# Altium schematic sheet Infinity Series 7 Breakout.SchDoc
size A; SheetNumber: 1; SheetTotal: 1
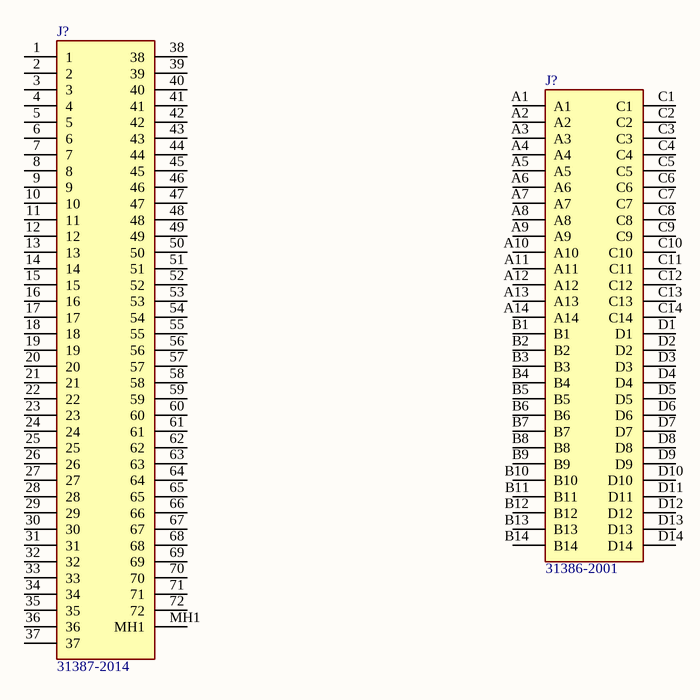
[diagram p0: Infinity Series 7 Breakout.SchDoc]

## Parts
(Parts that share a designator on the sheet are numbered #1, #2 ... from top to bottom, then left to right.)
J?#1  31387-2014  [313872014]
J?#2  31386-2001  [313862001]

## Nets

Not connected (* = marked no-connect by the designer): J?#1 1 2 3 4 5 6 7 8 9 10 11 12 13 14 15 16 17 18 19 20 21 22 23 24 25 26 27 28 29 30 31 32 33 34 35 36 37 38 39 40 41 42 43 44 45 46 47 48 49 50 51 52 53 54 55 56 57 58 59 60 61 62 63 64 65 66 67 68 69 70 71 72 MH1; J?#2 A1 A2 A3 A4 A5 A6 A7 A8 A9 A10 A11 A12 A13 A14 B1 B2 B3 B4 B5 B6 B7 B8 B9 B10 B11 B12 B13 B14 C1 C2 C3 C4 C5 C6 C7 C8 C9 C10 C11 C12 C13 C14 D1 D2 D3 D4 D5 D6 D7 D8 D9 D10 D11 D12 D13 D14

## Library data of the parts
J?#1 = 31387-2014: Connector; Manufacturer_Name: Molex; Datasheet Link: https://www.molex.com/pdm_docs/sd/313872014_sd.pdf; Height: 28.53mm; Manufacturer_Part_Number: 31387-2014; Mouser Part Number: 538-31387-2014; Mouser Price/Stock: https://www.mouser.co.uk/ProductDetail/Molex/31387-2014?qs=KsiteKi30G22U0MXrm34DQ%3D%3D
J?#2 = 31386-2001: Connector; Manufacturer_Name: Molex; Datasheet Link: https://componentsearchengine.com/Datasheets/2/31386-2001.pdf; Height: 28.4mm; Manufacturer_Part_Number: 31386-2001; Mouser Part Number: 538-31386-2001; Mouser Price/Stock: https://www.mouser.co.uk/ProductDetail/Molex/31386-2001?qs=NBj5Hwer2CGcnBgDOkup5A%3D%3D